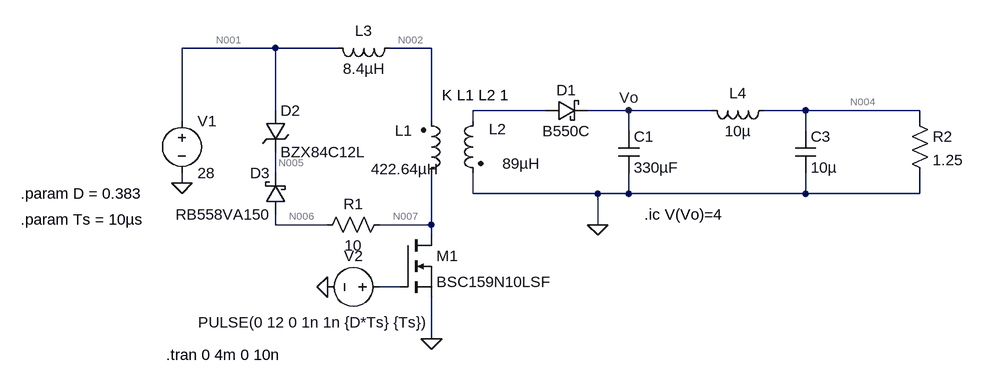
[diagram p0: schematic Flyback_Converter_3rd_Draft.asc]
Flyback_Converter_3rd_Draft.asc, the LTspice schematic file:
Version 4
SHEET 1 880 680
WIRE -320 0 -464 0
WIRE -224 0 -320 0
WIRE -80 0 -144 0
WIRE -320 96 -320 0
WIRE 96 96 -16 96
WIRE 224 96 160 96
WIRE 352 96 224 96
WIRE 496 96 432 96
WIRE 672 96 496 96
WIRE -464 112 -464 0
WIRE -80 112 -80 0
WIRE -16 112 -16 96
WIRE 672 112 672 96
WIRE 224 128 224 96
WIRE 496 128 496 96
WIRE -320 192 -320 160
WIRE -464 208 -464 192
WIRE -16 224 -16 192
WIRE 176 224 -16 224
WIRE 224 224 224 192
WIRE 224 224 176 224
WIRE 496 224 496 192
WIRE 496 224 224 224
WIRE 672 224 672 192
WIRE 672 224 496 224
WIRE -320 272 -320 256
WIRE -240 272 -320 272
WIRE -80 272 -80 192
WIRE -80 272 -160 272
WIRE 176 272 176 224
WIRE -80 288 -80 272
WIRE -128 368 -160 368
WIRE -80 448 -80 384
FLAG -464 208 0
FLAG -240 368 0
FLAG -80 448 0
FLAG 176 272 0
FLAG 224 96 Vo
SYMBOL voltage -464 96 R0
WINDOW 123 0 0 Left 2
WINDOW 39 0 0 Left 2
SYMATTR InstName V1
SYMATTR Value 28
SYMBOL ind2 -96 208 M180
WINDOW 0 -40 81 Left 2
WINDOW 3 -77 22 Left 2
SYMATTR InstName L1
SYMATTR Value 422.64µH
SYMATTR Type ind
SYMBOL ind2 0 96 M0
WINDOW 0 -36 29 Left 2
WINDOW 3 -87 82 Left 2
SYMATTR InstName L2
SYMATTR Value 89µH
SYMATTR Type ind
SYMBOL schottky 96 112 R270
WINDOW 0 32 32 VTop 2
WINDOW 3 0 32 VBottom 2
SYMATTR InstName D1
SYMATTR Value B550C
SYMATTR Description Diode
SYMATTR Type diode
SYMBOL cap 208 128 R0
SYMATTR InstName C1
SYMATTR Value 330µF
SYMATTR SpiceLine Rser=10m
SYMBOL nmos -128 288 R0
SYMATTR InstName M1
SYMATTR Value BSC159N10LSF
SYMBOL voltage -144 368 R90
WINDOW 0 -32 56 VBottom 2
WINDOW 3 39 117 VTop 2
WINDOW 123 0 0 Left 2
WINDOW 39 0 0 Left 2
SYMATTR InstName V2
SYMATTR Value PULSE(0 12 0 1n 1n {D*Ts} {Ts})
SYMBOL ind -128 -16 R90
WINDOW 0 5 56 VBottom 2
WINDOW 3 32 56 VTop 2
SYMATTR InstName L3
SYMATTR Value 8.4µH
SYMBOL ind 448 80 R90
WINDOW 0 5 56 VBottom 2
WINDOW 3 32 56 VTop 2
SYMATTR InstName L4
SYMATTR Value 10µ
SYMATTR SpiceLine Rser=20m
SYMBOL cap 480 128 R0
SYMATTR InstName C3
SYMATTR Value 10µ
SYMBOL res 656 96 R0
SYMATTR InstName R2
SYMATTR Value 1.25
SYMBOL zener -336 96 R0
SYMATTR InstName D2
SYMATTR Value BZX84C12L
SYMATTR Description Diode
SYMATTR Type diode
SYMBOL schottky -304 256 R180
WINDOW 0 24 64 Left 2
WINDOW 3 24 0 Left 2
SYMATTR InstName D3
SYMATTR Value RB558VA150
SYMATTR Description Diode
SYMATTR Type diode
SYMBOL res -144 256 R90
WINDOW 0 0 56 VBottom 2
WINDOW 3 32 56 VTop 2
SYMATTR InstName R1
SYMATTR Value 10
TEXT -64 72 Left 2 !K L1 L2 1
TEXT -712 224 Left 2 !.param D = 0.383
TEXT -712 264 Left 2 !.param Ts = 10µs
TEXT -488 472 Left 2 !.tran 0 4m 0 10n
TEXT 248 256 Left 2 !.ic V(Vo)=4

The netlist it stands for:
* Flyback_Converter_3rd_Draft.asc
V1 N001 0 28
L1 N007 N002 422.64µH
L2 N003 0 89µH
D1 N003 Vo B550C
C1 Vo 0 330µF Rser=10m
M1 N007 N008 0 0 BSC159N10LSF
V2 N008 0 PULSE(0 12 0 1n 1n {D*Ts} {Ts})
L3 N002 N001 8.4µH
L4 N004 Vo 10µ Rser=20m
C3 N004 0 10µ
R2 N004 0 1.25
D2 N001 N005 BZX84C12L
D3 N006 N005 RB558VA150
R1 N007 N006 10
.model D D
.lib standard.dio
.model NMOS NMOS
.model PMOS PMOS
.lib standard.mos
K L1 L2 1
.param D = 0.383
.param Ts = 10µs
.tran 0 4m 0 10n
.ic V(Vo)=4
.backanno
.end

* Results of the author's LTspice run, read from the files saved beside the schematic
* Operating Point, zero values left out:
*   V(n001) = 28 V
*   V(n007) = 28 V
*   V(n002) = 28 V
*   V(vo) = 4 V
*   V(n004) = 3.937 V
*   V(n005) = 28 V
*   V(n006) = 28 V
*   Id(M1) = 43.06 pA
*   Is(M1) = -43.06 pA
*   I(D1) = -243.6 µA
*   I(L4) = -3.15 A
*   I(L3) = -71.05 pA
*   I(L2) = 243.6 µA
*   I(L1) = -72.15 pA
*   I(R2) = 3.15 A
*   I(V1) = -72.76 pA